# EAGLE design S1D13705PCB (EAGLE 4.15)
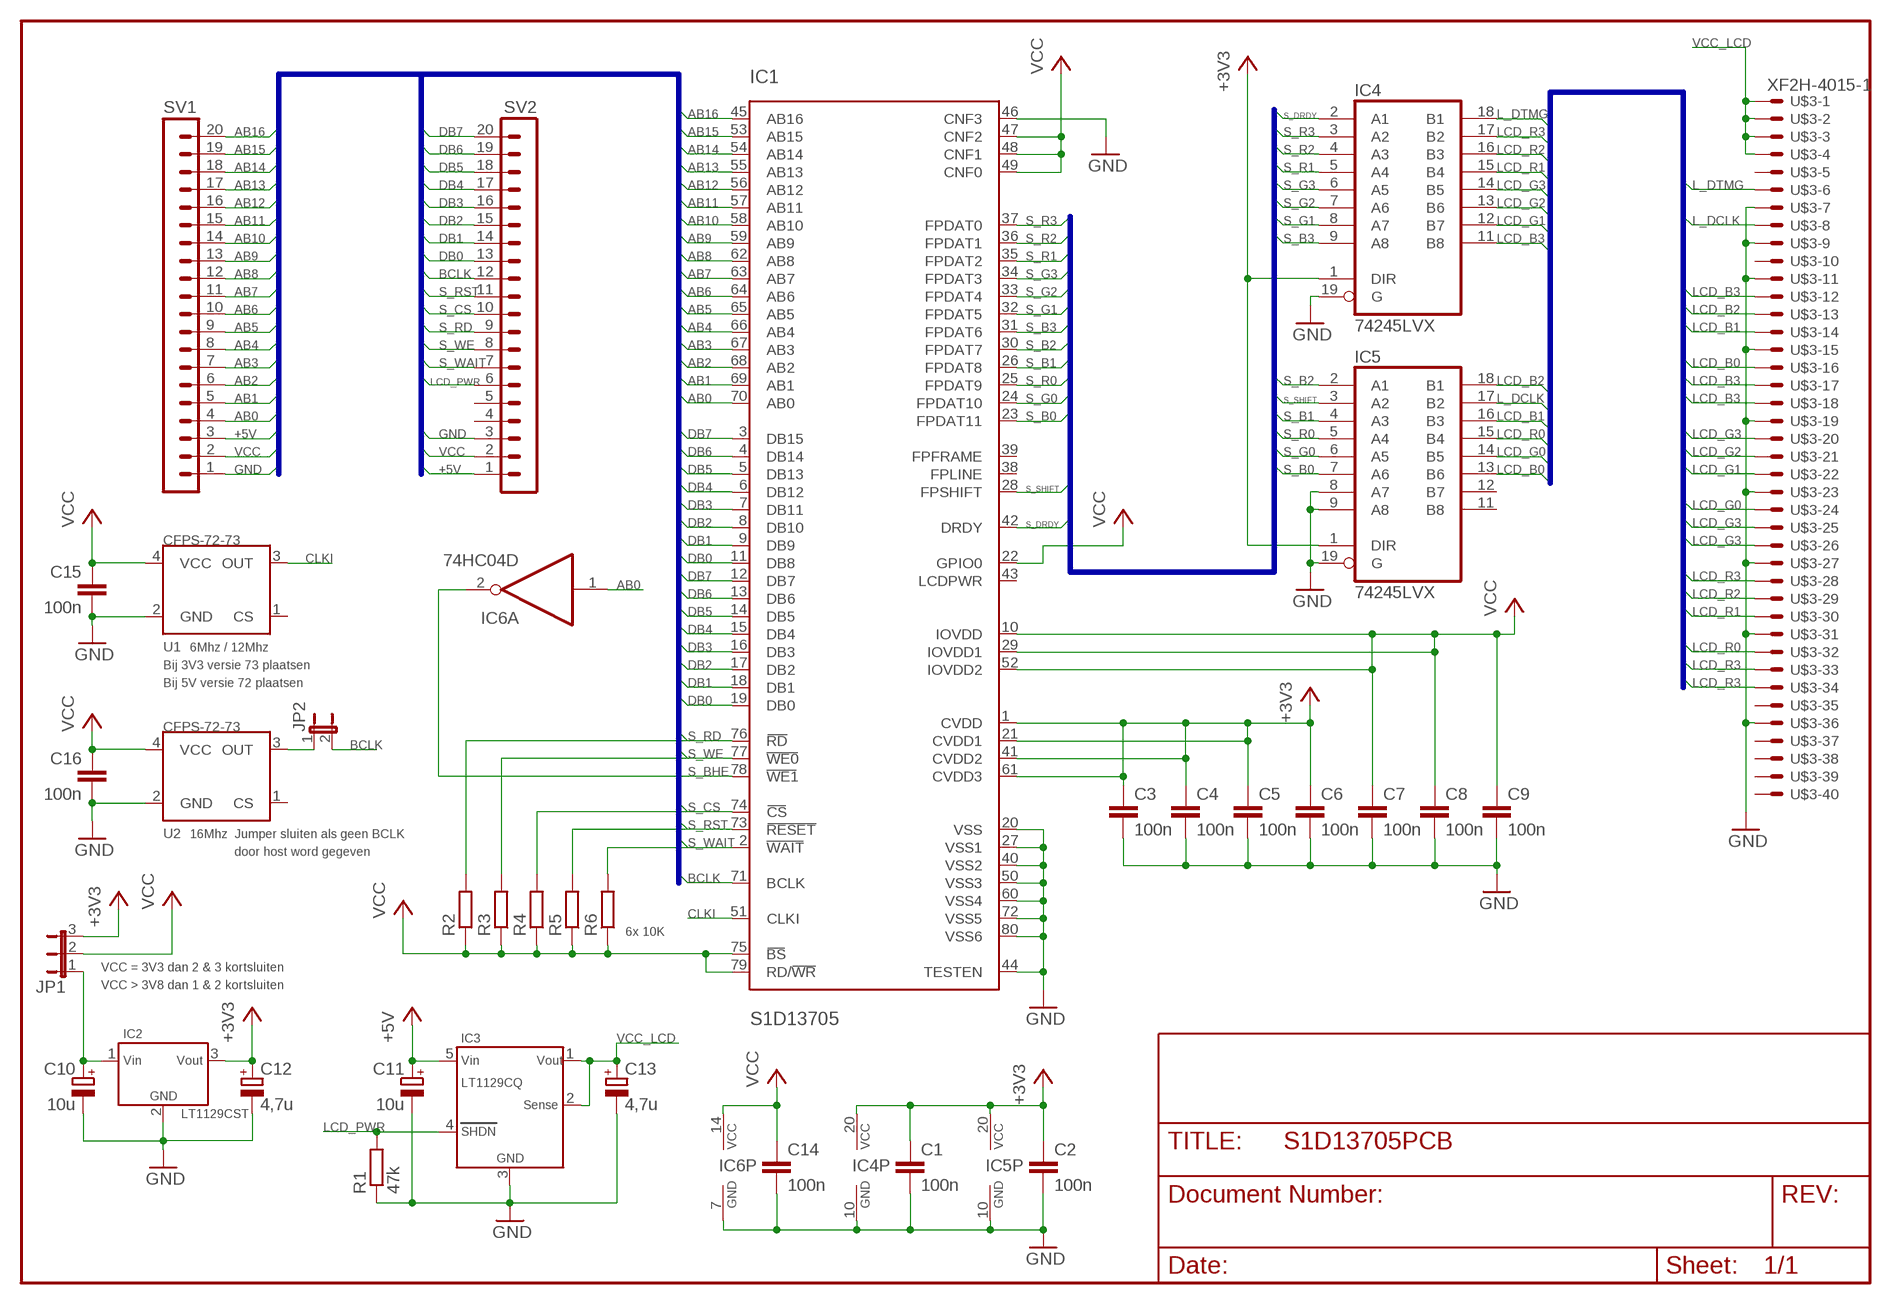
[diagram p0: schematic, sheet 1]

## Parts
C1  100n  C-EUC0603  [C0603]
C2  100n  C-EUC0603  [C0603]
C3  100n  C-EUC0603  [C0603]
C4  100n  C-EUC0603  [C0603]
C5  100n  C-EUC0603  [C0603]
C6  100n  C-EUC0603  [C0603]
C7  100n  C-EUC0603  [C0603]
C8  100n  C-EUC0603  [C0603]
C9  100n  C-EUC0603  [C0603]
C10  10u  CPOL-EUC  [PANASONIC_C]
C11  10u  CPOL-EUC  [PANASONIC_C]
C12  4,7u  CPOL-EUB  [PANASONIC_B]
C13  4,7u  CPOL-EUB  [PANASONIC_B]
C14  100n  C-EUC0805  [C0805]
C15  100n  C-EUC0805  [C0805]
C16  100n  C-EUC0805  [C0805]
IC1  S1D13705  [SQFP-S-12X12-80]
IC2  LT1129CST  [SOT223-R]
IC3  LT1129CQ  [Q5-DD]
IC4  74245LVX  [SSOP20]
IC5  74245LVX  [SSOP20]
IC6  74HC04D  [SO14]
JP1  JP2E  [JP2]
JP2  JP1E  [JP1]
R1  47k  R-EU_M0805  [M0805]
R2  R-EU_M0805  [M0805]
R3  R-EU_M0805  [M0805]
R4  R-EU_M0805  [M0805]
R5  R-EU_M0805  [M0805]
R6  R-EU_M0805  [M0805]
SV1  MA20-1  [MA20-1]
SV2  MA20-1  [MA20-1]
U1  CFPS-72-73  [CFPS]
U2  CFPS-72-73  [CFPS]
U$3  XF2H-4015-1  [XF2H-4015-1]

## Nets
+3V3: C1.1 C2.1 C3.1 C4.1 C5.1 C6.1 C12.+ IC1.1(CVDD) IC1.21(CVDD1) IC1.41(CVDD2) IC1.61(CVDD3) IC2.3(VOUT) IC4.1(DIR) IC4.20(VCC) IC5.1(DIR) IC5.20(VCC) JP1.3
+5V: C11.+ IC3.5(VIN) SV1.3 SV2.1
AB0: IC1.70(AB0) IC6.1(A:I) SV1.4
AB1: IC1.69(AB1) SV1.5
AB2: IC1.68(AB2) SV1.6
AB3: IC1.67(AB3) SV1.7
AB4: IC1.66(AB4) SV1.8
AB5: IC1.65(AB5) SV1.9
AB6: IC1.64(AB6) SV1.10
AB7: IC1.63(AB7) SV1.11
AB8: IC1.62(AB8) SV1.12
AB9: IC1.59(AB9) SV1.13
AB10: IC1.58(AB10) SV1.14
AB11: IC1.57(AB11) SV1.15
AB12: IC1.56(AB12) SV1.16
AB13: IC1.55(AB13) SV1.17
AB14: IC1.54(AB14) SV1.18
AB15: IC1.53(AB15) SV1.19
AB16: IC1.45(AB16) SV1.20
BCLK: IC1.71(BCLK) JP2.2 SV2.12
CLKI: IC1.51(CLKI) U1.3(OUT)
DB0: IC1.11(DB8) IC1.19(DB0) SV2.13
DB1: IC1.9(DB9) IC1.18(DB1) SV2.14
DB2: IC1.8(DB10) IC1.17(DB2) SV2.15
DB3: IC1.7(DB11) IC1.16(DB3) SV2.16
DB4: IC1.6(DB12) IC1.15(DB4) SV2.17
DB5: IC1.5(DB13) IC1.14(DB5) SV2.18
DB6: IC1.4(DB14) IC1.13(DB6) SV2.19
DB7: IC1.3(DB15) IC1.12(DB7) SV2.20
GND: C1.2 C2.2 C3.2 C4.2 C5.2 C6.2 C7.2 C8.2 C9.2 C10.- C11.- C12.- C13.- C14.2 C15.2 C16.2 IC1.20(VSS) IC1.27(VSS1) IC1.40(VSS2) IC1.44(TESTEN) IC1.46(CNF3) IC1.50(VSS3) IC1.60(VSS4) IC1.72(VSS5) IC1.80(VSS6) IC2.2(GND) IC3.3(GND) IC4.10(GND) IC4.19(G) IC5.8(A7) IC5.9(A8) IC5.10(GND) IC5.19(G) IC6.7(P:GND) R1.1 SV1.1 SV2.3 U1.2(GND) U2.2(GND) U$3.P$7 U$3.P$9 U$3.P$11 U$3.P$15 U$3.P$19 U$3.P$23 U$3.P$27 U$3.P$31 U$3.P$36
L_DCLK: IC5.17(B2) U$3.P$8
L_DTMG: IC4.18(B1) U$3.P$6
LCD_B0: IC5.13(B6) U$3.P$16
LCD_B1: IC5.16(B3) U$3.P$14
LCD_B2: IC5.18(B1) U$3.P$13
LCD_B3: IC4.11(B8) U$3.P$12 U$3.P$17 U$3.P$18
LCD_G0: IC5.14(B5) U$3.P$24
LCD_G1: IC4.12(B7) U$3.P$22
LCD_G2: IC4.13(B6) U$3.P$21
LCD_G3: IC4.14(B5) U$3.P$20 U$3.P$25 U$3.P$26
LCD_PWR: IC3.4(SHDN) R1.2 SV2.6
LCD_R0: IC5.15(B4) U$3.P$32
LCD_R1: IC4.15(B4) U$3.P$30
LCD_R2: IC4.16(B3) U$3.P$29
LCD_R3: IC4.17(B2) U$3.P$28 U$3.P$33 U$3.P$34
N$42: JP2.1 U2.3(OUT)
S_B0: IC1.23(FPDAT11) IC5.7(A6)
S_B1: IC1.26(FPDAT8) IC5.4(A3)
S_B2: IC1.30(FPDAT7) IC5.2(A1)
S_B3: IC1.31(FPDAT6) IC4.9(A8)
S_BHE: IC1.78(WE1) IC6.2(A:O)
S_CS: IC1.74(CS) R4.2 SV2.10
S_DRDY: IC1.42(DRDY) IC4.2(A1)
S_G0: IC1.24(FPDAT10) IC5.6(A5)
S_G1: IC1.32(FPDAT5) IC4.8(A7)
S_G2: IC1.33(FPDAT4) IC4.7(A6)
S_G3: IC1.34(FPDAT3) IC4.6(A5)
S_R0: IC1.25(FPDAT9) IC5.5(A4)
S_R1: IC1.35(FPDAT2) IC4.5(A4)
S_R2: IC1.36(FPDAT1) IC4.4(A3)
S_R3: IC1.37(FPDAT0) IC4.3(A2)
S_RD: IC1.76(RD) R2.2 SV2.9
S_RST: IC1.73(RESET) R5.2 SV2.11
S_SHIFT: IC1.28(FPSHIFT) IC5.3(A2)
S_WAIT: IC1.2(WAIT) R6.2 SV2.7
S_WE: IC1.77(WE0) R3.2 SV2.8
VCC: C7.1 C8.1 C9.1 C14.1 C15.1 C16.1 IC1.10(IOVDD) IC1.22(GPIO0) IC1.29(IOVDD1) IC1.47(CNF2) IC1.48(CNF1) IC1.49(CNF0) IC1.52(IOVDD2) IC1.75(BS) IC1.79(RD/WR) IC6.14(P:VCC) JP1.2 R2.1 R3.1 R4.1 R5.1 R6.1 SV1.2 SV2.2 U1.4(VCC) U2.4(VCC)
VCC_LCD: C13.+ IC3.1(VOUT) IC3.2(SENSE) U$3.P$1 U$3.P$2 U$3.P$3 U$3.P$4
VIN: C10.+ IC2.1(VIN) JP1.1
Unconnected: IC1.38(FPLINE) IC1.39(FPFRAME) IC1.43(LCDPWR) IC5.11(B8) IC5.12(B7) IC6.3(B:I) IC6.4(B:O) IC6.5(C:I) IC6.6(C:O) IC6.8(D:O) IC6.9(D:I) IC6.10(E:O) IC6.11(E:I) IC6.12(F:O) IC6.13(F:I) SV2.4 SV2.5 U1.1(CS) U2.1(CS) U$3.P$5 U$3.P$10 U$3.P$35 U$3.P$37 U$3.P$38 U$3.P$39 U$3.P$40

## Buses
B$1
B$2
B$3

## Notes on the sheet
- 6Mhz / 12Mhz
- Bij 3V3 versie 73 plaatsen
- Bij 5V versie 72 plaatsen
- 16Mhz | Jumper sluiten als geen BCLK
- door host word gegeven
- 6x 10K
- VCC = 3V3 dan 2 & 3 kortsluiten
- VCC > 3V8 dan 1 & 2 kortsluiten

## Library data of the parts
C1-C9 C14-C16 = rcl:C-EU: CAPACITOR, European symbol
C10-C13 = rcl:CPOL-EU: POLARIZED CAPACITOR, European symbol
IC1 = Patrick:S1D13705
IC2 = Patrick:LT1129CST
IC3 = Patrick:LT1129CQ
IC4 IC5 = 74xx-eu:74*245: Octal BUS TRANSCEIVER, 3-state
IC6 = 74xx-eu:74*04: Hex INVERTER
JP1 = jumper:JP2E: JUMPER
JP2 = jumper:JP1E: JUMPER
R1-R6 = rcl:R-EU_: RESISTOR, European symbol
SV1 SV2 = con-lstb:MA20-1: PIN HEADER
U1 U2 = Patrick:CFPS-72-73
U$3 = Patrick:XF2H-4015-1: FFC/FPC-to-Board 0.50mm (.020") SMT Top Contact

## Board
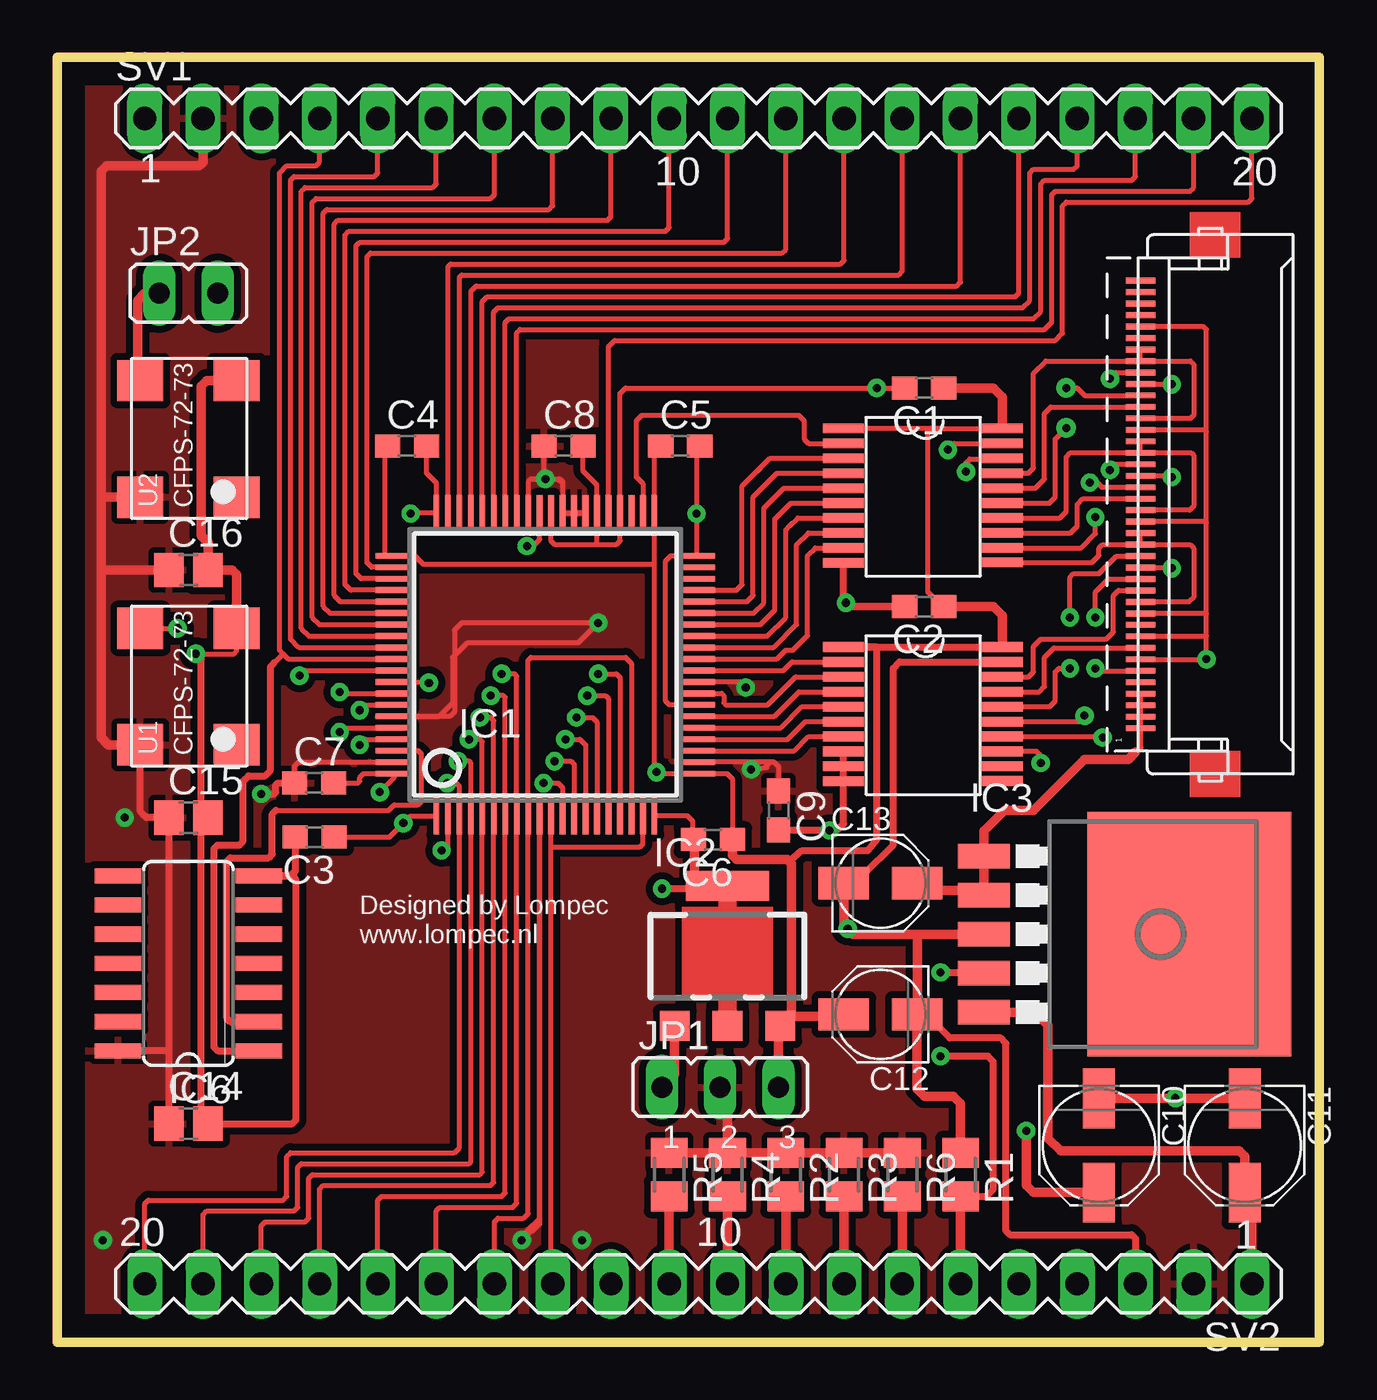
[diagram p1: board, top side]
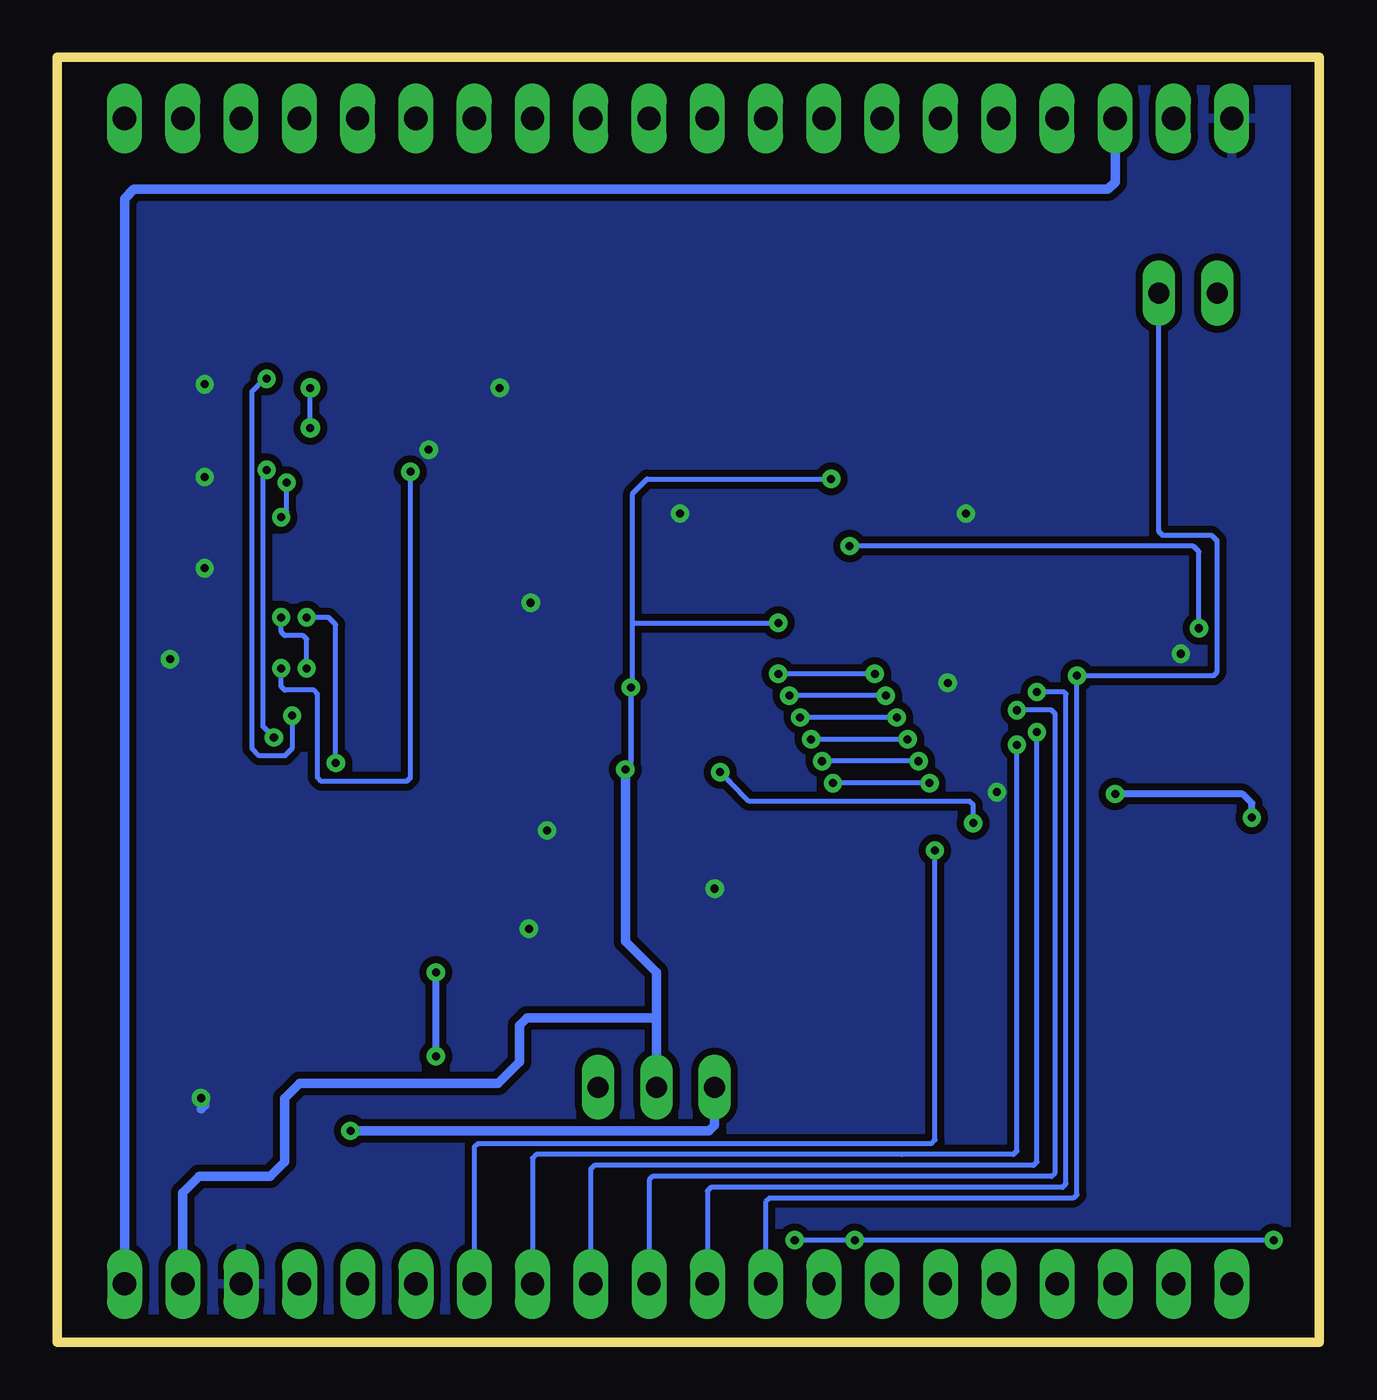
[diagram p2: board, bottom side, seen from below]

Size 55 x 56 mm. Coordinates in mm from the lower left corner, seen from the top.
Outline: 0,0 0,56 55,56 55,0 0,0
Copper layers (1*16): Top 0.035mm / dielectric 1.5mm / Bottom 0.035mm
Design rules "default": minimum track width 10mil, minimum drill 24mil, track to track 9mil, track to pad 9mil, pad to pad 9mil, via to via 9mil, smd to smd 9mil, copper to edge 40mil, drill to drill 8mil, minimum pad ring 10mil, minimum via ring 8mil, stop-mask expansion 4mil, vias tented up to drill 0mil, thermal gap 10mil

### Footprints (pad centres in the part's own frame; a part is rotated, then mirrored left to right if it is on the bottom)
C0603 = smd 1.1 x 1: 1 -0.85,0; 2 0.85,0
PANASONIC_C = smd 2.6 x 1.4: + 2.05,0; - -2.05,0
PANASONIC_B = smd 2.2 x 1.4: + 1.6,0; - -1.6,0
C0805 = smd 1.3 x 1.5: 1 -0.85,0; 2 0.85,0
SQFP-S-12X12-80 = smd 0.25 x 1.6: 1 -4.75,-6.6; 2 -4.25,-6.6; 3 -3.75,-6.6; 4 -3.25,-6.6; 5 -2.75,-6.6; 6 -2.25,-6.6; 7 -1.75,-6.6; 8 -1.25,-6.6; 9 -0.75,-6.6; 10 -0.25,-6.6; 11 0.25,-6.6; 12 0.75,-6.6; 13 1.25,-6.6; 14 1.75,-6.6; 15 2.25,-6.6; 16 2.75,-6.6; 17 3.25,-6.6; 18 3.75,-6.6; 19 4.25,-6.6; 20 4.75,-6.6; 41 4.75,6.6; 42 4.25,6.6; 43 3.75,6.6; 44 3.25,6.6; 45 2.75,6.6; 46 2.25,6.6; 47 1.75,6.6; 48 1.25,6.6; 49 0.75,6.6; 50 0.25,6.6; 51 -0.25,6.6; 52 -0.75,6.6; 53 -1.25,6.6; 54 -1.75,6.6; 55 -2.25,6.6; 56 -2.75,6.6; 57 -3.25,6.6; 58 -3.75,6.6; 59 -4.25,6.6; 60 -4.75,6.6 | smd 1.6 x 0.25: 21 6.6,-4.75; 22 6.6,-4.25; 23 6.6,-3.75; 24 6.6,-3.25; 25 6.6,-2.75; 26 6.6,-2.25; 27 6.6,-1.75; 28 6.6,-1.25; 29 6.6,-0.75; 30 6.6,-0.25; 31 6.6,0.25; 32 6.6,0.75; 33 6.6,1.25; 34 6.6,1.75; 35 6.6,2.25; 36 6.6,2.75; 37 6.6,3.25; 38 6.6,3.75; 39 6.6,4.25; 40 6.6,4.75; 61 -6.6,4.75; 62 -6.6,4.25; 63 -6.6,3.75; 64 -6.6,3.25; 65 -6.6,2.75; 66 -6.6,2.25; 67 -6.6,1.75; 68 -6.6,1.25; 69 -6.6,0.75; 70 -6.6,0.25; 71 -6.6,-0.25; 72 -6.6,-0.75; 73 -6.6,-1.25; 74 -6.6,-1.75; 75 -6.6,-2.25; 76 -6.6,-2.75; 77 -6.6,-3.25; 78 -6.6,-3.75; 79 -6.6,-4.25; 80 -6.6,-4.75
SOT223-R = smd 1.3 x 1.3: 1 -2.3,-3.05; 2 0,-3.05; 3 2.3,-3.05 | smd 3.6 x 1.3: 4 0,3.05
Q5-DD = smd 1.067 x 2.286: 1 -3.4,-7.875; 2 -1.7,-7.875; 3 0,-7.875; 4 1.7,-7.875; 5 3.4,-7.875 | smd 10.668 x 8.89: 6 0,1.087
SSOP20 = smd 1.78 x 0.42: 1 -0.975,5.85; 2 -0.975,5.2; 3 -0.975,4.55; 4 -0.975,3.9; 5 -0.975,3.25; 6 -0.975,2.6; 7 -0.975,1.95; 8 -0.975,1.3; 9 -0.975,0.65; 10 -0.975,0; 11 5.956,0.013; 12 5.956,0.65; 13 5.956,1.3; 14 5.956,1.95; 15 5.956,2.6; 16 5.956,3.25; 17 5.956,3.9; 18 5.956,4.55; 19 5.956,5.2; 20 5.956,5.85
SO14 = smd 0.66 x 2.032: 1 -3.81,-3.073; 2 -2.54,-3.073; 3 -1.27,-3.073; 4 0,-3.073; 5 1.27,-3.073; 6 2.54,-3.073; 7 3.81,-3.073; 8 3.81,3.073; 9 2.54,3.073; 10 1.27,3.073; 11 0,3.073; 12 -1.27,3.073; 13 -2.54,3.073; 14 -3.81,3.073
JP2 = drill 0.914 long: 1 -2.54,0; 2 0,0; 3 2.54,0
JP1 = drill 0.914 long: 1 0,-1.27; 2 0,1.27
M0805 = smd 1.3 x 1.6: 1 -0.95,0; 2 0.95,0
MA20-1 = drill 1.016 long: 1 -24.13,0; 2 -21.59,0; 3 -19.05,0; 4 -16.51,0; 5 -13.97,0; 6 -11.43,0; 7 -8.89,0; 8 -6.35,0; 9 -3.81,0; 10 -1.27,0; 11 1.27,0; 12 3.81,0; 13 6.35,0; 14 8.89,0; 15 11.43,0; 16 13.97,0; 17 16.51,0; 18 19.05,0; 19 21.59,0; 20 24.13,0
CFPS = smd 1.8 x 2: 1 -2.54,-2.1; 2 2.54,-2.1; 3 2.54,2.1; 4 -2.54,2.1
XF2H-4015-1 = smd 0.25 x 1.3: P$1 -9.75,2; P$2 -9.25,2; P$3 -8.75,2; P$4 -8.25,2; P$5 -7.75,2; P$6 -7.25,2; P$7 -6.75,2; P$8 -6.25,2; P$9 -5.75,2; P$10 -5.25,2; P$11 -4.75,2; P$12 -4.25,2; P$13 -3.75,2; P$14 -3.25,2; P$15 -2.75,2; P$16 -2.25,2; P$17 -1.75,2; P$18 -1.25,2; P$19 -0.75,2; P$20 -0.25,2; P$21 0.25,2; P$22 0.75,2; P$23 1.25,2; P$24 1.75,2; P$25 2.25,2; P$26 2.75,2; P$27 3.25,2; P$28 3.75,2; P$29 4.25,2; P$30 4.75,2; P$31 5.25,2; P$32 5.75,2; P$33 6.25,2; P$34 6.75,2; P$35 7.25,2; P$36 7.75,2; P$37 8.25,2; P$38 8.75,2; P$39 9.25,2; P$40 9.75,2

### Placement (x,y rotation side)
C1  37.78,41.59 180 top
C2  37.78,32.07 180 top
C3  11.22,22.01 180 top
C4  15.24,39.05 0 top
C5  27.15,39.05 0 top
C6  28.57,21.91 180 top
C7  11.19,24.37 0 top
C8  22.07,39.05 0 top
C9  31.43,23.18 270 top
C10  45.4,8.57 270 top
C11  51.75,8.57 270 top
C12  35.88,14.29 180 top
C13  35.88,20 0 top
C14  5.71,9.53 0 top
C15  5.71,22.86 0 top
C16  5.71,33.66 0 top
IC1  21.27,29.53 0 top
IC2  29.21,16.83 0 top
IC3  48.26,17.78 270 top
IC4  35.24,33.97 0 top
IC5  35.24,24.45 0 top
IC6  5.71,16.51 90 top
JP1  28.89,11.11 0 top
JP2  5.71,45.72 270 top
R1  39.37,7.3 270 top
R2  31.75,7.3 270 top
R3  34.29,7.3 270 top
R4  29.21,7.3 270 top
R5  26.67,7.3 270 top
R6  36.83,7.3 270 top
SV1  27.94,53.34 0 top
SV2  27.94,2.54 180 top
U1  5.71,28.57 90 top
U2  5.71,39.37 90 top
U$3  49.21,36.51 90 top

### Tracks (layer width: path | path; a pad name or v marks a point on that pad's centre or on a via)
+3V3  (via drill 0.35 pad 0.8)
  Top 0.225: IC5.20 41.25,30.3 41.27,30.32 | IC4.1 34.27,39.79 34.29,39.77 34.35,39.82 38.66,39.82 | 38.66,39.82 IC4.20 | 38.66,39.82 37.94,39.82 37.94,32.7 38.58,32.07 | C4.1 14.29,39.05 14.29,34.28 IC1.61 15.57,34.28 15.95,33.89 26.02,33.89 | C5.1 26.19,39.05 26.02,38.88 IC1.41 26.02,33.89 | C3.1 14.47,22.01 14.68,22.23 | 26.02,33.89 26.02,24.94 v26.11,24.84 26.18,24.78 IC1.21 29.2,24.78 29.29,24.69 | 14.68,22.23 | 14.68,22.23 v15.08,22.62 15.39,22.93 IC1.1 | 29.29,24.69 29.37,24.61 | 29.29,24.69 29.43,24.55 C6.1
  Top 0.305: IC5.20 41.2,30.32 41.17,30.3 IC5.1 35.72,30.3 35.72,21.91 35.32,21.43 32.47,21.43 31.91,20.95 | 31.91,20.95
  Top 0.406: JP1.3 31.43,13.65 31.51,13.73 IC2.3 31.51,14.21 31.99,14.21 | IC4.20 41.2,41.19 40.8,41.59 C1.1 | IC5.20 41.2,31.67 40.8,32.07 C2.1 38.58,32.07 38.5,32.07 | C12.+ 34.28,14.22 34.29,14.21 31.99,14.21 | C6.1 29.43,21.22 29.61,21.03 31.83,21.03 31.91,20.95 31.99,20.88 31.99,14.21
  Bottom 0.225: v15.08,22.62 15.08,23.42 15.24,23.57 24.84,23.57 25.64,24.37 | 25.64,24.37 25.8,24.53 | 25.64,24.37 v26.11,24.84
+5V
  Top 0.406: SV2.1 52.07,6.19 C11.+ 51.75,8.1 51.51,8.33 43.74,8.33 43.18,8.89 43.18,13.81 42.94,14.05 | 42.94,14.05 42.78,14.21 | 42.94,14.05 | IC3.5 42.61,14.38 42.94,14.05
  Bottom 0.406: SV1.3 8.89,50.56 9.21,50.24 51.67,50.24 52.07,49.85 SV2.1 52.07,2.46
AB0
  Top 0.225: IC1.70 10.07,29.78 9.84,30 | 9.84,30 9.68,30.16 9.68,50.96 10,51.28 11.27,51.28 11.43,51.44 SV1.4 | 9.45,29.61 9.84,30
  Top 0.305: IC6.1 6.99,12.7 6.83,12.86 6.83,21.51 6.99,21.67 7.94,21.67 8.1,21.83 8.1,24.45 8.18,24.53 | 9.05,24.69 9.29,24.92 9.29,29.45 9.45,29.61 | 9.05,24.69 | 9.05,24.69 8.33,24.69 8.18,24.53 | 8.18,24.53
AB1
  Top 0.225: IC1.69 10.52,30.28 10.16,30.64 10.16,50.64 10.32,50.8 13.81,50.8 13.97,50.96 SV1.5
AB2
  Top 0.225: IC1.68 10.97,30.78 10.64,31.11 10.64,50.16 10.79,50.32 16.35,50.32 16.51,50.48 SV1.6
AB3
  Top 0.225: IC1.67 11.43,31.28 11.11,31.59 11.11,49.69 11.27,49.85 18.89,49.85 19.05,50.01 SV1.7
AB4
  Top 0.225: IC1.66 11.88,31.78 11.59,32.07 11.59,49.21 11.75,49.37 21.43,49.37 21.59,49.53 SV1.8
AB5
  Top 0.225: IC1.65 12.33,32.28 12.06,32.54 12.06,48.74 12.22,48.9 23.97,48.9 24.13,49.05 SV1.9
AB6
  Top 0.225: IC1.64 12.78,32.78 12.54,33.02 12.54,48.26 12.7,48.42 26.51,48.42 26.67,48.58 SV1.10
AB7
  Top 0.225: IC1.63 13.24,33.28 13.02,33.5 13.02,47.78 13.18,47.94 29.05,47.94 29.21,48.1 SV1.11
AB8
  Top 0.225: IC1.62 13.69,33.78 13.49,33.97 13.49,47.31 13.65,47.47 31.59,47.47 31.75,47.62 SV1.12 31.75,53.5
AB9
  Top 0.225: IC1.59 17.02,46.87 17.14,46.99 34.13,46.99 34.29,47.15 SV1.13
AB10
  Top 0.225: IC1.58 17.52,46.41 17.62,46.51 36.67,46.51 36.83,46.67 SV1.14
AB11
  Top 0.225: IC1.57 18.02,45.8 18.26,46.04 39.21,46.04 39.37,46.2 SV1.15
AB12
  Top 0.225: IC1.56 18.52,45.35 18.73,45.56 41.75,45.56 41.91,45.72 SV1.16
AB13
  Top 0.225: IC1.55 19.02,44.9 19.21,45.09 42.07,45.09 42.39,45.4 42.39,50.96 42.55,51.12 44.29,51.12 44.45,51.28 SV1.17 44.61,53.34 44.45,53.18
AB14
  Top 0.225: IC1.54 19.52,44.45 19.68,44.61 42.55,44.61 42.86,44.93 42.86,50.48 43.02,50.64 46.83,50.64 46.99,50.8 SV1.18
AB15
  Top 0.225: IC1.53 20.02,43.99 20.16,44.13 43.02,44.13 43.34,44.45 43.34,50.01 43.5,50.16 49.37,50.16 49.53,50.32 SV1.19
AB16
  Top 0.225: IC1.45 24.02,43.39 24.29,43.66 43.5,43.66 43.81,43.97 43.81,49.53 43.97,49.69 51.91,49.69 52.07,49.85 SV1.20
BCLK  (via drill 0.35 pad 0.8)
  Top 0.225: IC1.71 10.78,29.28 v10.56,29.05
  Bottom 0.225: SV2.12 24.13,6.11 23.97,6.27 10.72,6.27 10.56,6.43 v10.56,29.05 4.6,29.05 4.45,29.21 4.45,34.92 4.68,35.16 6.83,35.16 6.99,35.32 JP2.2
CLKI  (via drill 0.35 pad 0.8)
  Top 0.225: U1.3 v5.24,31.11 | v20.47,34.7 20.73,34.7 21.02,34.99 IC1.51
  Bottom 0.225: v5.24,31.11 5.24,34.45 5.32,34.53 | 5.32,34.53 5.4,34.61 | v20.47,34.7 5.49,34.7 5.32,34.53
DB0
  Top 0.225: 21.52,21.59 21.52,2.61 SV2.13 | 21.52,21.59 IC1.11 | IC1.19 25.52,21.71 25.4,21.59 21.52,21.59
DB1
  Top 0.225: SV2.14 19.05,5.24 19.21,5.4 20.32,5.4 20.52,5.6 IC1.9 20.52,29.73 20.64,29.84 | IC1.18 25.02,29.59 24.77,29.84 20.64,29.84 | 20.64,29.84 20.56,29.77
DB2  (via drill 0.35 pad 0.8)
  Top 0.225: SV2.15 16.51,5.71 16.67,5.87 19.84,5.87 20.02,6.05 IC1.8 20.02,29.03 19.92,29.13 v19.37,29.13 | v23.57,29.13 24.37,29.13 | 24.37,29.13 24.45,29.05 | 24.37,29.13 | IC1.17 24.52,28.98 24.37,29.13
  Bottom 0.225: v19.37,29.13 v23.57,29.13
DB3  (via drill 0.35 pad 0.8)
  Top 0.225: SV2.16 13.97,6.19 14.13,6.35 19.37,6.35 19.52,6.5 IC1.7 19.52,28.1 19.45,28.18 v18.89,28.18 | v23.1,28.18 23.89,28.18 | 23.89,28.18 23.97,28.1 | 23.89,28.18 | IC1.16 24.02,28.05 23.89,28.18
  Bottom 0.225: v18.89,28.18 v23.1,28.18
DB4  (via drill 0.35 pad 0.8)
  Top 0.225: 11.43,2.38 SV2.17 11.43,6.67 11.59,6.83 18.89,6.83 19.02,6.96 IC1.6 19.02,27.09 18.89,27.23 18.73,27.23 v18.41,27.23 | IC1.15 23.52,27.04 23.34,27.23 v22.62,27.23
  Bottom 0.225: v18.41,27.23 v22.62,27.23
DB5  (via drill 0.35 pad 0.8)
  Top 0.225: SV2.18 8.89,5.08 9.05,5.24 10.79,5.24 10.95,5.4 10.95,7.14 11.11,7.3 18.41,7.3 18.52,7.41 IC1.5 18.52,26.17 18.41,26.27 v17.94,26.27 | v22.15,26.27 22.78,26.27 | 22.78,26.27 22.86,26.19 | 22.78,26.27 | IC1.14 23.02,26.03 22.78,26.27
  Bottom 0.225: v17.94,26.27 v22.15,26.27
DB6  (via drill 0.35 pad 0.8)
  Top 0.225: SV2.19 6.35,5.56 6.51,5.71 10.32,5.71 10.48,5.87 10.48,7.62 10.64,7.78 17.94,7.78 18.02,7.86 IC1.4 18.02,25.24 17.94,25.32 v17.46,25.32 | v21.67,25.32 22.38,25.32 | 22.38,25.32 22.46,25.24 | IC1.13 22.52,25.18 22.38,25.32
  Bottom 0.225: v17.46,25.32 v21.67,25.32
DB7  (via drill 0.35 pad 0.8)
  Top 0.225: SV2.20 3.81,6.03 3.97,6.19 9.84,6.19 10,6.35 10,8.1 10.16,8.26 17.3,8.26 17.52,8.47 IC1.3 17.52,24.23 17.38,24.37 v16.99,24.37 | v21.19,24.37 21.83,24.37 | 21.83,24.37 21.91,24.29 | 21.83,24.37 | IC1.12 22.02,24.17 21.83,24.37
  Bottom 0.225: v16.99,24.37 v21.19,24.37
GND  (via drill 0.35 pad 0.8)
  Top 0.225: C7.2 13.1,24.37 13.18,24.45 13.18,24.61 13.35,24.78 IC1.80 14.67,24.59 v14.05,23.97 | U1.2 7.82,30.12 7.7,30 v6.03,30 | C3.2 10.37,9.65 10.24,9.53 6.59,9.53 6.27,9.84 | 16.27,37.7 16.52,37.45 IC1.60 v15.41,36.13 v15.4,36.12 | 16.27,37.7 16.19,37.78 | C4.2 16.09,37.88 16.27,37.7 | 23.26,37.62 23.52,37.36 IC1.46 23.52,34.79 23.5,34.77 | 23.26,37.62 23.18,37.7 | 23.26,37.62 | C8.2 22.92,37.97 23.26,37.62 | C5.2 27.86,39.05 27.87,39.04 IC1.40 | IC1.72 16.15,28.78 v16.19,28.73 | C1.2 36.99,41.59 | v35.72,41.59 24.77,41.59 24.52,41.35 IC1.44 24.53,36.12 24.53,34.92 24.37,34.77 23.5,34.77 | v35.72,41.59 C1.2 | U$3.P$31 48.57,41.76 v48.58,41.75 | U$3.P$23 48.52,37.76 v48.58,37.7 | U$3.P$15 48.55,33.76 v48.58,33.73 | U$3.P$36 49.96,44.26 50.09,44.13 50.09,39.69 | 50.09,30.8 v50.09,29.77 v50.08,29.76 U$3.P$7 | 50.09,30.8 50.09,31.75 | 50.09,31.75 50.09,35.72 | 50.09,35.72 50.09,39.69 | U$3.P$11 50.07,31.76 50.09,31.75 | U$3.P$9 50.05,30.76 50.09,30.8 | U$3.P$19 50.04,35.76 50.09,35.72 | U$3.P$27 50.01,39.76 50.09,39.69 | IC4.19 39.09,39.17 v38.81,38.89 | IC1.50 21.52,34.91 21.67,34.77 23.42,34.77 | 23.42,34.77 | 23.42,34.77 23.5,34.77 | IC1.40 27.87,36.1 v27.86,36.12 | v35.72,41.59 C1.2 | IC1.27 26.67,27.78 26.51,27.94 26.51,34.05 26.59,34.13 | 26.59,34.13 26.67,34.21 | 26.59,34.13 | IC1.40 26.74,34.28 26.59,34.13 | IC1.20 27.48,22.93 27.7,22.7 27.7,21.91 C6.2
  Top 0.305: 10.24,20.4 10.16,20.32 IC6.7 10.24,20.32 10.4,20.16 10.4,9.68 10.24,9.53 C14.2 6.51,9.53 6.27,9.76 6.27,9.84 | 10.24,20.4 10.32,20.48 | C3.2 10.37,20.53 10.24,20.4 | C15.2 6.27,22.86 6.19,22.78 6.27,22.78 6.27,9.84 | 34.23,25.1 34.21,25.08 | 34.23,25.1 IC5.9 34.27,24.5 34.21,24.45 IC5.10 34.27,22.6 34.13,22.46 | IC5.8 34.27,25.14 34.23,25.1 | C9.2 34,22.33 | 34,22.33 34.13,22.46 | 34.13,22.46 34.21,22.54 | 34.13,22.46 | IC4.10 34.27,32.33 34.53,32.07 | C2.2 36.99,32.07 | C2.2 34.53,32.07 | 6.27,9.84 6.27,29.77 v6.03,30 | IC5.19 36.71,29.65 36.43,29.37 36.43,21.67 35.16,20.4 34.61,20.4 | C13.- 34.28,20.07 34.61,20.4 | 29.21,19.76 v26.35,19.76 | 34,22.33 33.68,22.33 v33.66,22.3 | 34.53,32.07 C2.2 | v34.37,32.23 34.53,32.07 | 34.61,20.4 34.61,20.24 34.29,19.92 34.29,18.18 v34.45,18.02 | SV2.3 46.99,4.52 46.83,4.68 41.51,4.68 41.35,4.84 41.35,13.02 41.12,13.26 38.89,13.26 37.86,14.29 C12.-
  Top 0.406: R1.1 39.37,10.4 39.05,10.72 37.78,10.72 37.47,11.03 37.47,14.21 37.48,14.22 C12.- 37.48,17.77 37.47,17.78 | C13.- 34.28,18.19 v34.45,18.02 34.69,17.78 37.47,17.78 | 37.47,17.78 IC3.3 | C11.- 51.75,10.64 51.74,10.62 C10.- 48.72,10.62 v48.74,10.64 | U1.2 7.82,33.46 7.62,33.66 C16.2 6.57,34.87 6.27,35.16 6.27,41.67 6.51,41.91 U2.2 | 29.21,19.76 28.18,19.76 27.78,20.16 27.78,21.99 27.73,21.93 C6.2
  Top 0.813: IC2.2 29.21,19.76
  Bottom 0.225: v14.05,23.97 14.21,23.97 | v6.03,30 6.03,30.24 | v15.4,36.12 15.4,36.27 | v16.19,28.73 16.19,28.97 | v48.58,41.75 48.58,41.67 | v48.58,37.7 48.58,37.78 | v48.58,33.73 48.58,33.81 | v50.09,29.77 49.93,29.77 | v38.81,38.89 38.81,38.97 | v27.86,36.12 27.94,36.2 | v35.72,41.59 35.56,41.59
  Bottom 0.305: v26.35,19.76 26.35,19.61 | v33.66,22.3 33.66,22.38 | v48.74,10.64 48.66,10.64 | v34.37,32.23 | v34.37,32.23 34.29,32.31 | v34.45,18.02 34.53,17.94
  Bottom 0.406: 48.82,10.64 v48.74,10.64 48.58,10.64 48.58,10.32 48.74,10.16
  pour Bottom (isolate 0.305): 54.53,55.56 0.48,55.56 0.48,55.48 0.48,0.48 54.53,0.48
L_DCLK
  Top 0.225: IC5.17 42.79,28.35 43.02,28.57 43.02,29.84 43.44,30.26 U$3.P$8
L_DTMG  (via drill 0.35 pad 0.8)
  Top 0.225: U$3.P$6 45.35,29.26 v45.24,29.37 | IC4.18 41.2,38.5 39.77,38.5 39.61,38.34 v39.61,37.94
  Bottom 0.225: v45.24,29.37 45.24,28.57 45.09,28.42 43.81,28.42 43.66,28.26 43.66,24.61 43.5,24.45 39.77,24.45 39.61,24.61 v39.61,37.94
LCD_B0  (via drill 0.35 pad 0.8)
  Top 0.225: U$3.P$16 46.17,34.26 45.4,33.5 44.29,33.5 44.13,33.34 v44.13,31.59 | 42.86,25.56 42.7,25.72 | v42.86,25.24 42.86,25.56 | IC5.13 42.67,25.75 42.86,25.56
  Bottom 0.225: v44.13,31.59 43.18,31.59 42.86,31.27 v42.86,25.24
LCD_B1  (via drill 0.35 pad 0.8)
  Top 0.225: IC5.16 43.26,27.7 43.5,27.94 43.5,29.21 43.66,29.37 v44.13,29.37 | U$3.P$14 45.8,33.26 45.24,32.7 v45.24,31.59
  Bottom 0.225: v45.24,31.59 45.24,30.96 45.09,30.8 44.29,30.8 44.13,30.64 44.13,29.69 v44.13,29.37
LCD_B2
  Top 0.225: IC5.18 42.33,29 42.55,29.21 42.55,30.32 42.86,30.64 45.72,30.64 46.04,30.96 46.04,32.54 46.26,32.76 U$3.P$13
LCD_B3
  Top 0.225: U$3.P$18 | U$3.P$17 U$3.P$18 | U$3.P$18 47.21,35.27 | IC4.11 45.1,33.98 45.4,34.29 45.4,34.61 45.56,34.76 U$3.P$17 | U$3.P$17 49.38,34.76 49.53,34.61 49.53,32.46 | 49.53,32.46 49.37,32.31 | 49.53,32.46 | U$3.P$12 49.33,32.26 49.53,32.46
LCD_G0  (via drill 0.35 pad 0.8)
  Top 0.225: U$3.P$24 46.12,38.26 v45.88,38.02 | IC5.14 45.52,26.4 v45.56,26.35
  Bottom 0.225: v45.88,38.02 45.88,37.94 46.04,37.78 46.04,26.83 v45.56,26.35
LCD_G1  (via drill 0.35 pad 0.8)
  Top 0.225: IC4.12 44.62,34.62 45.24,35.24 v45.24,35.96 | 45.32,37.47 v45.01,37.47 45.32,37.47 | 45.32,37.47 45.48,37.31 | U$3.P$22 45.53,37.26 45.32,37.47
  Bottom 0.225: v45.24,35.96 | v45.24,35.96 45.01,36.2 v45.01,37.47
LCD_G2
  Top 0.225: IC4.13 44.16,35.27 44.45,35.56 44.45,36.51 44.7,36.76 U$3.P$21
LCD_G3
  Top 0.225: U$3.P$26 | U$3.P$25 U$3.P$26 | U$3.P$26 47.21,39.27 | IC4.14 43.7,35.92 43.97,36.2 43.97,38.58 44.16,38.76 U$3.P$25 | U$3.P$25 49.42,38.76 49.53,38.66 49.53,36.43 | 49.53,36.43 49.45,36.35 | 49.53,36.43 | U$3.P$20 49.36,36.26 49.53,36.43
LCD_PWR  (via drill 0.35 pad 0.8)
  Top 0.305: R1.2 40.48,6.35 40.8,6.67 40.8,12.22 40.56,12.46 v38.5,12.46 | IC3.4 40.38,16.1 40.4,16.11 v38.5,16.11
  Top 0.406: SV2.6 R1.2
  Bottom 0.305: v38.5,12.46 v38.5,16.11
LCD_R0  (via drill 0.35 pad 0.8)
  Top 0.225: U$3.P$32 46.15,42.26 v45.88,41.99 | IC5.15 44.51,27.05 v44.77,27.3
  Bottom 0.225: v45.88,41.99 45.96,41.99 46.51,41.43 46.51,25.88 46.2,25.56 45.09,25.56 44.77,25.88 v44.77,27.3
LCD_R1  (via drill 0.35 pad 0.85)
  Top 0.225: IC4.15 43.24,36.57 43.5,36.83 43.5,39.37 v43.97,39.85 | v43.97,41.59 44.45,41.59 44.61,41.43 | 44.61,41.43 44.77,41.27 | 44.61,41.43 | U$3.P$30 44.78,41.26 44.61,41.43
  Bottom 0.225: v43.97,39.85 v43.97,41.59
LCD_R2
  Top 0.225: IC4.16 42.62,37.22 43.02,37.62 43.02,40.48 43.3,40.76 U$3.P$29
LCD_R3
  Top 0.225: U$3.P$34 | U$3.P$33 U$3.P$34 | U$3.P$34 | IC4.17 42.32,37.87 42.55,38.1 42.55,42.23 43.08,42.76 U$3.P$33 | U$3.P$33 49.39,42.76 49.53,42.62 49.53,40.4 | 49.53,40.4 49.45,40.32 | U$3.P$28 49.39,40.26 49.53,40.4
N$1  (via drill 0.35 pad 0.8)
  other vias: 45.88,41.99
N$2  (via drill 0.35 pad 0.85)  (1 unrouted)
  other vias: 43.97,39.85 43.97,39.85
N$3  (via drill 0.35 pad 0.85)
  other vias: 43.97,41.59
N$4  (via drill 0.35 pad 0.8)
  other vias: 16.99,24.37
N$5  (via drill 0.35 pad 0.8)
  other vias: 44.13,31.59
N$6  (via drill 0.35 pad 0.8)
  other vias: 45.24,35.96
N$7  (via drill 0.35 pad 0.8)
  other vias: 45.01,37.47
N$8  (via drill 0.35 pad 0.8)
  other vias: 45.88,38.02
N$9  (via drill 0.35 pad 0.8)
  other vias: 45.24,31.59
N$10  (via drill 0.35 pad 0.8)
  other vias: 17.46,25.32
N$11  (via drill 0.35 pad 0.8)
  other vias: 42.86,25.24
N$12  (via drill 0.35 pad 0.8)
  other vias: 45.24,29.37
N$13  (via drill 0.35 pad 0.8)
  other vias: 17.94,26.27
N$14  (via drill 0.35 pad 0.8)
  other vias: 18.41,27.23
N$15  (via drill 0.35 pad 0.8)
  other vias: 18.89,28.18
N$16  (via drill 0.35 pad 0.8)
  other vias: 19.37,29.13
N$17  (via drill 0.35 pad 0.8)
  other vias: 21.19,24.37
N$18  (via drill 0.35 pad 0.8)
  other vias: 21.67,25.32
N$19  (via drill 0.35 pad 0.8)
  other vias: 22.15,26.27
N$20  (via drill 0.35 pad 0.8)
  other vias: 22.62,27.23
N$21  (via drill 0.35 pad 0.8)
  other vias: 23.1,28.18
N$22  (via drill 0.35 pad 0.8)
  other vias: 23.57,29.13
N$23  (via drill 0.35 pad 0.8)
  other vias: 13.18,26.04
N$24  (via drill 0.35 pad 0.8)
  other vias: 12.3,26.59
N$25  (via drill 0.35 pad 0.8)
  other vias: 13.18,27.54
N$26  (via drill 0.35 pad 0.8)
  other vias: 12.3,28.34
N$27  (via drill 0.35 pad 0.8)
  other vias: 16.75,21.43
N$28  (via drill 0.35 pad 0.8)
  other vias: 10.56,29.05
N$30  (via drill 0.35 pad 0.8)
  other vias: 5.24,31.11
N$31  (via drill 0.35 pad 0.8)
  other vias: 15.08,22.62
N$32  (via drill 0.35 pad 0.8)
  other vias: 38.5,16.11
N$42
  Top 0.406: JP2.1 3.81,45.72 3.49,45.4 3.49,41.91 U2.3
S_B0
  Top 0.225: IC1.23 32.13,25.78 32.75,26.4 IC5.7
S_B1
  Top 0.225: IC1.26 31.25,27.28 32.32,28.35 IC5.4
S_B2
  Top 0.225: IC1.30 31.66,29.28 32.03,29.65 IC5.2
S_B3
  Top 0.225: IC1.31 31.36,29.78 31.75,30.16 32.07,30.16 32.7,30.8 32.7,34.29 33.03,34.62 IC4.9
S_BHE
  Top 0.225: IC1.78 15.74,25.78 15.88,25.64 15.88,23.57 15.72,23.42 14.68,23.42 14.45,23.18 9.53,23.18
  Top 0.305: IC6.2 7.54,13.97 7.38,14.13 7.38,20.95 7.54,21.11 9.21,21.11 9.37,21.27 9.37,23.02 9.53,23.18
S_CS  (via drill 0.35 pad 0.8)
  Top 0.225: IC1.74 13.41,27.78 v13.18,27.54
  Top 0.406: SV2.10 R4.2
  Bottom 0.225: v13.18,27.54 11.67,27.54 11.51,27.38 11.51,7.38 11.67,7.22 29.05,7.22 29.21,7.06 SV2.10 29.21,2.46
S_DRDY
  Top 0.225: IC1.42 25.52,37.42 25.24,37.7 25.24,40.16 25.48,40.4 32.31,40.4 32.54,40.16 32.54,39.37 32.74,39.17 IC4.2
S_G0
  Top 0.225: IC1.24 31.83,26.28 32.6,27.05 IC5.6
S_G1
  Top 0.225: IC1.32 31.23,30.28 32.23,31.27 32.23,34.77 32.73,35.27 IC4.8
S_G2
  Top 0.225: IC1.33 30.94,30.78 31.75,31.59 31.75,35.4 31.91,35.56 | 31.91,35.56 32.07,35.72 | 31.91,35.56 | IC4.7 32.27,35.92 31.91,35.56
S_G3
  Top 0.225: IC1.34 30.64,31.28 31.27,31.91 31.27,35.88 31.97,36.57 IC4.6
S_R0
  Top 0.225: IC1.25 31.54,26.78 32.46,27.7 IC5.5
S_R1
  Top 0.225: IC1.35 30.35,31.78 30.8,32.23 30.8,36.35 31.27,36.83 | 31.27,36.83 31.43,36.99 | 31.27,36.83 | IC4.5 31.67,37.22 31.27,36.83
S_R2
  Top 0.225: IC1.36 30.05,32.28 30.32,32.54 30.32,36.83 31.36,37.87 IC4.4
S_R3
  Top 0.225: IC1.37 29.6,32.78 29.84,33.02 29.84,37.31 30.32,37.78 | 30.32,37.78 30.64,38.1 | IC4.3 31.06,38.52 30.32,37.78
S_RD  (via drill 0.35 pad 0.8)
  Top 0.225: IC1.76 12.49,26.78 v12.3,26.59
  Top 0.406: R2.2 31.43,6.35 31.75,6.03 SV2.9
  Bottom 0.225: v12.3,26.59 12.3,7.86 12.46,7.7 31.59,7.7 31.75,7.54 SV2.9 31.75,2.46
S_RST  (via drill 0.35 pad 0.8)
  Top 0.225: IC1.73 12.36,28.28 v12.3,28.34
  Top 0.406: SV2.11 R5.2
  Bottom 0.225: v12.3,28.34 11.11,28.34 11.03,28.26 11.03,6.91 11.19,6.75 26.51,6.75 26.67,6.59 SV2.11 26.67,2.46
S_SHIFT
  Top 0.225: IC5.3 32.17,29 31.51,28.34 | 31.51,28.34 31.45,28.28 | IC1.28 28.95,28.28 29.05,28.18 29.05,27.86 29.13,27.78 30.96,27.78 31.51,28.34 | 31.51,28.34
S_WAIT  (via drill 0.35 pad 0.8)
  Top 0.225: IC1.2 17.02,21.55 16.91,21.43 v16.75,21.43
  Top 0.406: SV2.7 R6.2
  Bottom 0.225: v16.75,21.43 16.75,8.81 16.91,8.65 36.67,8.65 36.83,8.49 SV2.7
S_WE  (via drill 0.35 pad 0.8)
  Top 0.225: IC1.77 13.42,26.28 v13.18,26.04
  Top 0.406: SV2.8 R3.2
  Bottom 0.225: 34.29,2.46 SV2.8 34.29,8.02 34.13,8.18 18.18,8.18 13.34,8.18 13.18,8.33 v13.18,26.04
VCC  (via drill 0.35 pad 0.8)
  Top 0.225: IC1.48 | IC1.48 IC1.49 22.02,37.51 21.91,37.62 21.83,37.62 | IC1.48 | IC1.48 | IC1.48 IC1.47 IC1.49 22.02,37.31 22.02,37.44 21.83,37.62 | 20.64,37.62 20.95,37.62 21.22,37.88 C8.1 | IC1.79 10.51,25.28 10.34,25.11 C7.1 | IC1.52 20.52,37.51 20.64,37.62 | 20.64,37.62 v21.27,37.62 21.83,37.62 | 31.24,25.28 IC1.22 | 31.24,25.28 31.43,25.08 C9.1 | IC1.10 21.02,5.15 20.72,4.84 20.48,4.84 | 20.48,4.84 20.32,4.68 | IC1.29 29.76,28.78 v30,28.54 | 31.24,25.28 31.07,25.28 30.88,25.08 | 30.88,25.08 30.84,25.04 | 30.88,25.08 30.92,25.04 v30.24,24.96 | IC1.10 21.02,5.39 20.48,4.84 | IC1.10 21.02,5.23 v20.24,4.45 | v22.86,4.45 22.86,4.52 | 17.12,27.28 IC1.75 16.64,27.28 17.22,27.86 17.22,29.84 17.86,30.48 22.7,30.48 v23.57,31.35 17.62,31.35 17.3,31.04 17.3,27.46 17.12,27.28
  Top 0.305: 4.84,22.86 C15.1 | C14.1 4.87,12.7 | 4.87,12.7 4.87,22.84 4.84,22.86 | 4.87,12.7 IC6.14 | 4.84,22.86 3.89,22.86 3.73,23.02 | 3.73,23.02 3.65,23.1 | U1.4 3.62,23.13 3.73,23.02 | C7.1 9.6,24.37 9.53,24.29 9.53,23.97 9.45,23.89 v8.89,23.89 | 2.94,22.7 v2.94,22.86
  Top 0.406: R4.1 29.13,8.25 29.13,8.26 29.13,8.25 R5.1 | R4.1 R2.1 R3.1 | R3.1 34.37,8.25 34.37,8.26 | R6.1 R3.1 | R4.1 29.21,10.79 JP1.2 | U1.4 2.22,26.04 1.91,26.35 1.91,33.66 | 3.65,36.83 U2.4 1.91,36.83 | 1.91,33.66 C16.1 | 1.91,33.66 1.91,36.83 | 1.91,36.83 1.91,51.04 2.14,51.28 6.19,51.28 6.35,51.44 SV1.2
  Bottom 0.225: v30.24,24.96 30,25.28 v30,28.54 30,28.57 | v21.27,37.62 29.29,37.62 29.92,36.99 29.92,31.35 | 29.92,31.35 v23.57,31.35 | 29.92,31.35 29.92,28.65 30,28.57 | 30,28.57 30,25.16 30.24,24.92 | v22.86,4.45 v20.24,4.45 v1.98,4.45
  Bottom 0.305: v8.89,23.89 3.33,23.89 2.94,23.5 v2.94,22.86
  Bottom 0.406: 30.24,24.92 30.24,17.46 28.89,16.11 28.89,14.13 | JP1.2 28.89,14.13 | SV2.2 49.53,6.51 48.82,7.22 45.72,7.22 45.09,7.86 45.09,10.64 44.45,11.27 35.8,11.27 34.85,12.22 34.85,13.81 34.53,14.13 28.89,14.13
  pour Top (isolate 0.305): 0.48,55.48 54.45,55.48 54.45,0.64 0.48,0.56
  pour Top (isolate 0.305): 0.56,55.48 54.45,55.48 54.45,51.44 54.29,1.03 0.4,1.03 0.56,55.48 0.64,55.48
VCC_LCD
  Top 0.254: 47.21,27.78 U$3.P$3 U$3.P$2 | 47.21,27.78 U$3.P$4 | 47.21,27.78 | U$3.P$2 | U$3.P$1 U$3.P$2 | U$3.P$1 | U$3.P$1 47.21,25.94 46.67,25.4
  Top 0.406: 40.38,21.21 IC3.1 | 40.38,21.21 IC3.2 40.38,19.62 40.32,19.68 37.47,19.68 37.48,19.7 C13.+ | 40.38,21.21 40.32,21.27 | 40.38,21.21 40.38,22.29 41.27,23.18 42.55,23.18 44.77,25.4 46.67,25.4 46.99,25.72
VIN  (via drill 0.35 pad 0.8)
  Top 0.406: IC2.1 26.91,11.67 JP1.1 | C10.+ 42.53,6.52 42.23,6.83 v42.23,9.21
  Bottom 0.406: v42.23,9.21 26.59,9.21 26.35,9.45 JP1.1
(copper drawn outside any net)
  shapes: Top area x3

### Text on the board
tNames: Designed by Lompec | www.lompec.nl